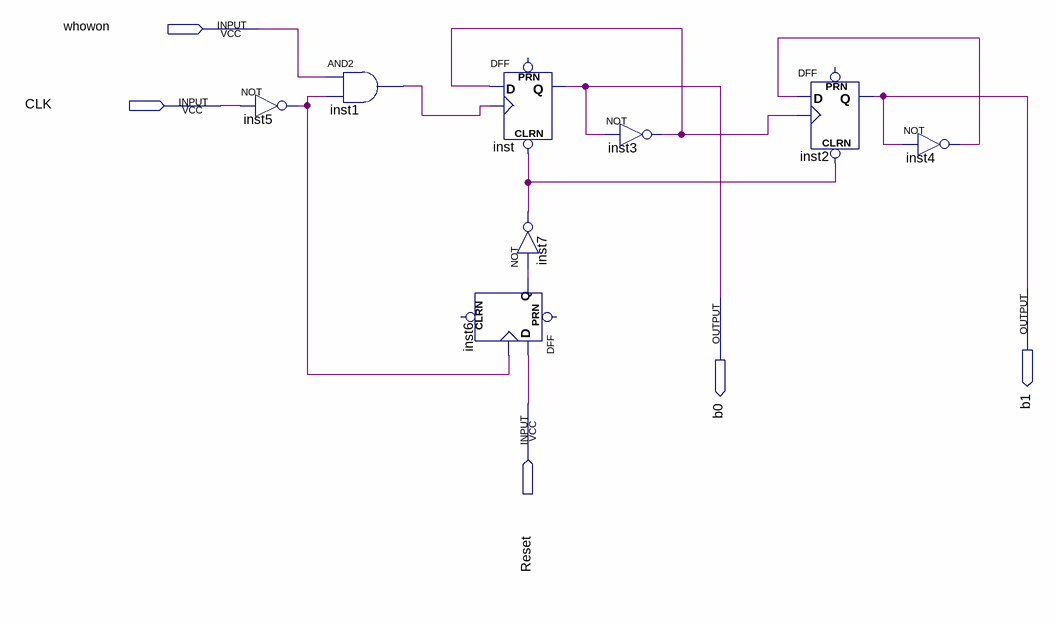
[diagram p0: schematic sheet]
// Quartus schematic CounterWithReset.bdf as structural Verilog: 8 symbols, 5 pins
module CounterWithReset (
  input  whowon,
  input  CLK,
  input  Reset,
  output b1,
  output b0
);

  wire inst1_out, inst3_out, inst4_out, inst5_out, inst6_q, inst7_out;

  not inst5 (inst5_out, CLK);
  and inst1 (inst1_out, whowon, inst5_out);
  DFF inst6 (.CLK(inst5_out), .D(Reset), .Q(inst6_q));  // open: CLRN, PRN
  DFF inst (.CLRN(inst7_out), .CLK(inst1_out), .D(inst3_out), .Q(b0));  // open: PRN
  not inst7 (inst7_out, inst6_q);
  not inst3 (inst3_out, b0);
  DFF inst2 (.CLRN(inst7_out), .CLK(inst3_out), .D(inst4_out), .Q(b1));  // open: PRN
  not inst4 (inst4_out, b1);
endmodule
